# Altium schematic sheet M_GPIO_ADC.SchDoc
size Letter
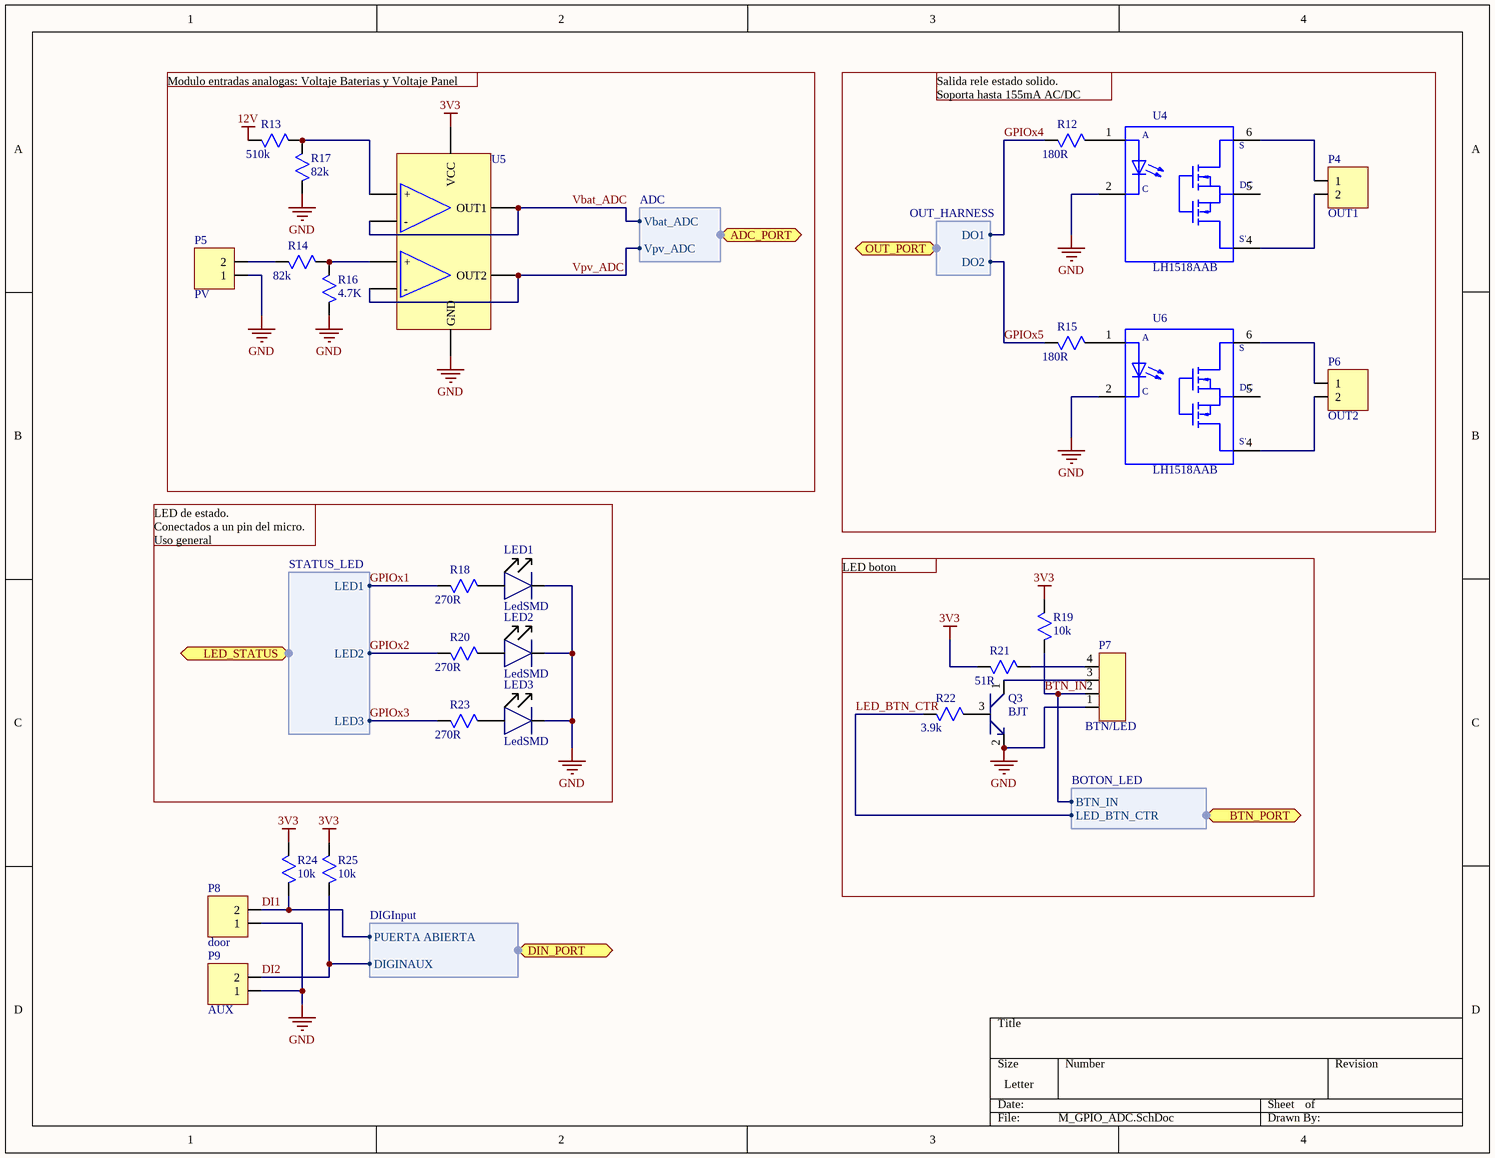
[diagram p0: M_GPIO_ADC.SchDoc]

## Parts
LED1  LedSMD  [SMD1206]
LED2  LedSMD  [SMD1206]
LED3  LedSMD  [SMD1206]
P4  OUT1  [TBHDR2P3.5VERTICAL]
P5  PV  [TBHDR2P3.5VERTICAL]
P6  OUT2  [TBHDR2P3.5VERTICAL]
P7  BTN/LED  [TBHDR4P3.5]
P8  door  [TBHDR2P3.5VERTICAL]
P9  AUX  [TBHDR2P3.5VERTICAL]
Q3  BJT  [BJT]
R12  value 180R  [ResistorSMD0805]  (hidden comment: ResistorSMD)
R13  value 510k  [ResistorSMD0805]  (hidden comment: ResistorSMD)
R14  value 82k  [ResistorSMD0805]  (hidden comment: ResistorSMD)
R15  value 180R  [ResistorSMD0805]  (hidden comment: ResistorSMD)
R16  value 4.7K  [ResistorSMD0805]  (hidden comment: ResistorSMD)
R17  value 82k  [ResistorSMD0805]  (hidden comment: ResistorSMD)
R18  value 270R  [ResistorSMD0805]  (hidden comment: ResistorSMD)
R19  value 10k  [ResistorSMD0805]  (hidden comment: ResistorSMD)
R20  value 270R  [ResistorSMD0805]  (hidden comment: ResistorSMD)
R21  value 51R  [ResistorSMD0805]  (hidden comment: ResistorSMD)
R22  value 3.9k  [ResistorSMD0805]  (hidden comment: ResistorSMD)
R23  value 270R  [ResistorSMD0805]  (hidden comment: ResistorSMD)
R24  value 10k  [ResistorSMD0805]  (hidden comment: ResistorSMD)
R25  value 10k  [ResistorSMD0805]  (hidden comment: ResistorSMD)
U4  LH1518AAB  [SOIC254P1005X390-6N]
U5  Operacional  [SO8]  (value not drawn)
U6  LH1518AAB  [SOIC254P1005X390-6N]

## Ports
ADC_PORT (harness ADC), BTN_PORT (harness BOTON_LED), DIN_PORT (harness DIGInput), LED_STATUS (harness STATUS_LED), OUT_PORT (harness OUT_HARNESS)

## Harnesses
ADC: Vbat_ADC, Vpv_ADC
STATUS_LED: LED1, LED2, LED3
BOTON_LED: BTN_IN, LED_BTN_CTR
OUT_HARNESS: DO1, DO2
DIGInput: PUERTA ABIERTA, DIGINAUX

## Nets
3V3: R19.2 R21.1 R24.2 R25.2 U5.8(VCC)
12V: R13.1
GND: LED1.1 LED2.1 LED3.1 P5.1 P7.1 P8.1 P9.1 Q3.2 R16.1 R17.1 U4.2(C) U5.4(GND) U6.2(C)
BTN_IN: P7.2 R19.1 ; port BTN_PORT.BTN_IN
DI1: P8.2 R24.1 ; port DIN_PORT.PUERTA ABIERTA
DI2: P9.2 R25.1 ; port DIN_PORT.DIGINAUX
GPIOx1: R18.1 ; port LED_STATUS.LED1
GPIOx2: R20.1 ; port LED_STATUS.LED2
GPIOx3: R23.1 ; port LED_STATUS.LED3
GPIOx4: R12.1 ; port OUT_PORT.DO1
GPIOx5: R15.1 ; port OUT_PORT.DO2
LED_BTN_CTR: R22.1 ; port BTN_PORT.LED_BTN_CTR
Vbat_ADC: U5.1(OUT1) U5.2(-) ; port ADC_PORT.Vbat_ADC
Vpv_ADC: U5.6(-) U5.7(OUT2) ; port ADC_PORT.Vpv_ADC
NetLED1_2: LED1.2 R18.2
NetLED2_2: LED2.2 R20.2
NetLED3_2: LED3.2 R23.2
NetP4_1: P4.1 U4.6(S)
NetP4_2: P4.2 U4.4(S')
NetP5_2: P5.2 R14.1
NetP6_1: P6.1 U6.6(S)
NetP6_2: P6.2 U6.4(S')
NetP7_3: P7.3 Q3.1
NetP7_4: P7.4 R21.2
NetQ3_3: Q3.3 R22.2
NetR12_2: R12.2 U4.1(A)
NetR13_2: R13.2 R17.2 U5.3(+)
NetR14_2: R14.2 R16.2 U5.5(+)
NetR15_2: R15.2 U6.1(A)

Not connected (* = marked no-connect by the designer): U4 5(DC); U6 5(DC)

## Notes on the sheet
- Modulo entradas analogas: Voltaje Baterias y Voltaje Panel solar
- Salida rele estado solido.
  Soporta hasta 155mA AC/DC
- LED de estado.
  Conectados a un pin del micro.
  Uso general
- LED boton

## Library data of the parts
LED1-LED3 = LedSMD: Discrete Led SMD 1205 Green; PartNo: LTST-C150GKT; Manufacturer Name: Lite-On Inc.; PartDescription: LED GREEN CLEAR 1206 SMD; Type: Surface Mount; Digi-Key Part Number: 160-1169-1-ND; Package: 1206 (3216 Metric); Distributors Part Number: 160-1169-1-ND; Manufacturers Part Number: LTST-C150GKT
P4-P6 P8 P9 = TBHDR2P3.5: Connector 2 positions with pitch 3.5mm; PartNo: 691321100002; Manufacturer Name: Wurth Electronics Inc.; PartDescription: TERM BLOCK HDR 2POS VERT 3.5MM; Digi-Key Part Number: 732-2763-ND; Package: 0.138" (3.50mm) Vertical Through Hole; Distributors Part Number: 732-2763-ND; Manufacturers Part Number: 691321100002; Type: Through Hole; Value: 2 Position
P7 = TBHDR4P3.5: Connector 4 positions; PartNo: 691321100004; Manufacturer Name: Wurth Electronics Inc.; PartDescription: TERM BLOCK HDR 4POS VERT 3.5MM; Digi-Key Part Number: 732-2765-ND; Package: 0.138" (3.50mm) Vertical Through Hole; Distributors Part Number: 732-2765-ND; Manufacturers Part Number: 691321100004; Type: Through Hole; Value: 4 Position
Q3 = BJT: Transistor BJT; Manufacturer Name: Diodes Incorporated; Manufacturers Part Number: MMBT2222A-7-F; PartDescription: TRANS NPN 40V 0.6A SMD SOT23-3; Type: Surface Mount; Digi-Key Part Number: MMBT2222A-FDICT-ND; Distributors Part Number: MMBT2222A-FDICT-ND; Package: TO-236-3, SC-59, SOT-23-3; PartNo: MMBT2222A-7-F
R12 R15 = ResistorSMD: Chip Resistor SMD; Manufacturer Name: Yageo; Manufacturers Part Number: RC0805FR-07180RL; PartDescription: RES SMD 180 OHM 1% 1/8W 0805; Digi-Key Part Number: 311-180CRCT-ND; Distributors Part Number: 311-180CRCT-ND; Package: 0805 (2012 Metric); PartNo: RC0805FR-07180RL; Type: Surface Mount
R13 = ResistorSMD: Chip Resistor SMD; PartNo: RC0805FR-07510KL; Manufacturer Name: Yageo; PartDescription: RES SMD 510K OHM 1% 1/8W 0805; Digi-Key Part Number: 311-510KCRCT-ND; Package: 0805; Distributors Part Number: 311-510KCRCT-ND; Manufacturers Part Number: RC0805FR-07510KL; Type: Surface Mount
R14 R17 = ResistorSMD: Chip Resistor SMD; PartNo: RC0805FR-0782KL; Manufacturer Name: Yageo; PartDescription: RES SMD 82K OHM 1% 1/8W 0805; Digi-Key Part Number: 311-82.0KCRCT-ND; Package: 0805; Distributors Part Number: 311-82.0KCRCT-ND; Manufacturers Part Number: RC0805FR-0782KL; Type: Surface Mount
R16 = ResistorSMD: Chip Resistor SMD; PartNo: ERJ-6GEYJ472V; Manufacturer Name: Panasonic Electronic Components; PartDescription: RES SMD 4.7K OHM 5% 1/8W 0805; Digi-Key Part Number: P4.7KACT-ND; Package: 0805 (2012 Metric); Distributors Part Number: P4.7KACT-ND; Manufacturers Part Number: ERJ-6GEYJ472V; Type: Surface Mount
R18 R20 R23 = ResistorSMD: Chip Resistor SMD; Manufacturer Name: Panasonic Electronic Components; Manufacturers Part Number: ERJ-6ENF2700V; PartDescription: RES SMD 270 OHM 1% 1/8W 0805; Digi-Key Part Number: P270CCT-ND; Distributors Part Number: P270CCT-ND; Package: 0805 (2012 Metric); PartNo: ERJ-6ENF2700V; Type: Surface Mount
R19 R24 R25 = ResistorSMD: Chip Resistor SMD; Manufacturer Name: Yageo; Manufacturers Part Number: RC0805FR-0710KL; PartDescription: RES SMD 10K OHM 1% 1/8W 0805; Digi-Key Part Number: 311-10.0KCRCT-ND; Distributors Part Number: 311-10.0KCRCT-ND; Type: Surface Mount; Package: 0805 (2012 Metric); PartNo: RC0805FR-0710KL
R21 = ResistorSMD: Chip Resistor SMD; Manufacturer Name: Bourns Inc.; Manufacturers Part Number: CRM0805-FX-51R0ELF; PartDescription: RES SMD 51 OHM 1% 1/4W 0805; Digi-Key Part Number: CRM0805-FX-51R0ELFCT-ND; Distributors Part Number: CRM0805-FX-51R0ELFCT-ND; Package: 0805 (2012 Metric); PartNo: CRM0805-FX-51R0ELF; Type: Surface Mount
R22 = ResistorSMD: Chip Resistor SMD; Manufacturer Name: Yageo; Manufacturers Part Number: RC0603FR-073K9L; PartDescription: RES SMD 3.9K OHM 1% 1/10W 0603; Digi-Key Part Number: 311-3.90KHRCT-ND; Distributors Part Number: 311-3.90KHRCT-ND; Package: 0603 (1608 Metric); PartNo: RC0603FR-073K9L; Type: Surface Mount
U4 U6 = LH1518AAB: LH1518AAB Series SPST _1 Form A_ Solid State Relay Surface Mount - SMD-6; Manufacturer Name: Vishay; PartDescription: SSR RELAY SPST-NO 300MA 0-250V; Package: 6-SMD (0.300", 7.62mm); Value: *; Digi-Key Part Number: LH1518AAB-ND; Distributors Part Number: LH1518AAB-ND; Manufacturers Part Number: LH1518AAB; PartNo: LH1518AAB; Type: Surface Mount
U5 = Operacional: 2channel Vcc=4-16Vmax; PartNo: LM358DT; Manufacturer Name: STMicroelectronics; PartDescription: IC OPAMP GP 1.1MHZ 8SO; Digi-Key Part Number: 497-1591-1-ND; Distributors Part Number: 497-1591-1-ND; Manufacturers Part Number: LM358DT; Package: 8-SOIC (0.154", 3.90mm Width); Type: Surface Mount